# Altium schematic sheet Schematic_Phat.SchDoc
size A; PageSetup: Record=PageOptions|CenterHorizontal=True|CenterVertical=True|PrintScale=1.00|XCorrection=1.00|YCorrection=1.00|PrintKind=0|BorderSize=5000000|LeftOffset=0|BottomOffset=0|Orientation=2|PaperLength=1000|PaperWidth=1000|Scale=100|PaperSource=7|PrintQuality=-3|MediaType=1|DitherType=10|PrintScaleMode=0|PaperKind=A4|PaperIndex=9
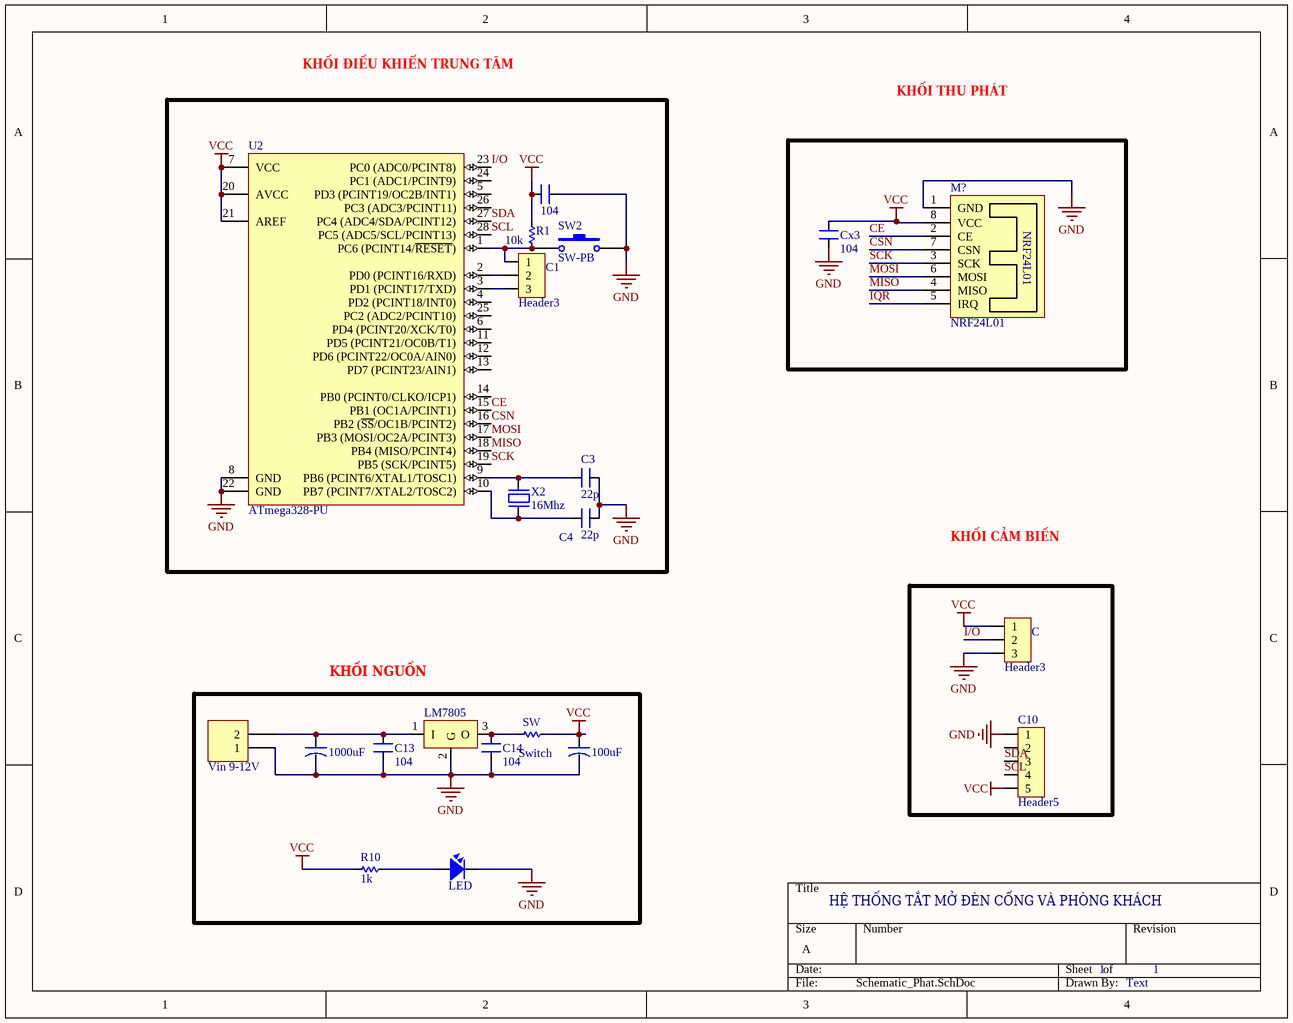
[diagram p0: Schematic_Phat.SchDoc]

## Parts
100uF  CN-ALU-DIP  [CA-ALU-2.54]  (value not drawn)
1000uF  CN-ALU-DIP  [CA-ALU-2.54]  (value not drawn)
?  104  [CN-SMD-0805]
C  Header3  [HDR3]
C1  Header3  [HDR3]
C3  22p  [CN-SMD-0805]
C4  22p  [CN-SMD-0805]
C10  Header5  [HDR5]
C13  104  [CN-SMD-0805]
C14  104  [CN-SMD-0805]
Cx3  104  [CN-SMD-0805]
LED  LED  [LED-3MM-RED]  (value not drawn)
LM7805  LM78xx  [TO220-123]  (value not drawn)
M?  NRF24L01  [JP4-C2T]
R1  10k  [RES-SMD-0805]
R10  1k  [RES-SMD-0805]
SW  Switch  [RES-1/4W-SMALL]
SW2  SW-PB  [SPST-2]
U2  ATmega328-PU  [DIP28]
Vin_9-12V  Domino 2  [DOMINO 2- 5mm]  (value not drawn)
X2  16Mhz  [XT2]

## Blocks framed on the sheet
KHỐI NGUỒN: 100uF 1000uF C13 C14 LED LM7805 R10 SW Vin_9-12V

## Nets
GND: 100uF.2 1000uF.2 ?.1 C.3 C3.1 C4.1 C10.1 C13.1 C14.1 Cx3.1 LED.2 LM7805.2(G) M?.1(GND) SW2.2 U2.8(GND) U2.22(GND) Vin_9-12V.1
VCC: 100uF.1 ?.2 C.1 C10.5 Cx3.2 M?.8(VCC) R1.1 R10.2 SW.1 U2.7(VCC) U2.20(AVCC) U2.21(AREF)
CE: M?.2(CE) U2.15(PB1_(OC1A/PCINT1))
CSN: M?.7(CSN) U2.16(PB2_(~{SS}/OC1B/PCINT2))
I/O: C.2 U2.23(PC0_(ADC0/PCINT8))
IQR: M?.5(IRQ)
MISO: M?.4(MISO) U2.18(PB4_(MISO/PCINT4))
MOSI: M?.6(MOSI) U2.17(PB3_(MOSI/OC2A/PCINT3))
SCK: M?.3(SCK) U2.19(PB5_(SCK/PCINT5))
SCL: C10.4 U2.28(PC5_(ADC5/SCL/PCINT13))
SDA: C10.3 U2.27(PC4_(ADC4/SDA/PCINT12))
Net1000uF_1: 1000uF.1 C13.2 LM7805.1(I) Vin_9-12V.2
NetC1_1: C1.1 R1.2 SW2.1 U2.1(PC6_(PCINT14/~{RESET}))
NetC1_2: C1.2 U2.2(PD0_(PCINT16/RXD))
NetC1_3: C1.3 U2.3(PD1_(PCINT17/TXD))
NetC3_2: C3.2 U2.9(PB6_(PCINT6/XTAL1/TOSC1)) X2.2
NetC4_2: C4.2 U2.10(PB7_(PCINT7/XTAL2/TOSC2)) X2.1
NetC14_2: C14.2 LM7805.3(O) SW.2
NetLED_1: LED.1 R10.1

Not connected (* = marked no-connect by the designer): C10 2; U2 4(PD2_(PCINT18/INT0)) 5(PD3_(PCINT19/OC2B/INT1)) 6(PD4_(PCINT20/XCK/T0)) 11(PD5_(PCINT21/OC0B/T1)) 12(PD6_(PCINT22/OC0A/AIN0)) 13(PD7_(PCINT23/AIN1)) 14(PB0_(PCINT0/CLKO/ICP1)) 24(PC1_(ADC1/PCINT9)) 25(PC2_(ADC2/PCINT10)) 26(PC3_(ADC3/PCINT11))

## Notes on the sheet
- KHỐI ĐIỀU KHIỂN TRUNG TÂM
- KHỐI THU PHÁT
- KHỐI CẢM BIẾN
- HỆ THỐNG TẮT MỞ ĐÈN CỔNG VÀ PHÒNG KHÁCH
- 1
- Text

## Library data of the parts
100uF 1000uF = CN-ALU-DIP: Capacitor (Semiconductor SIM Model); Value: 104; LatestRevisionDate: 17-Jul-2002; LatestRevisionNote: Re-released for DXP Platform.; PackageReference: C1206; Publisher: Altium Limited
? C3 C4 C13 C14 Cx3 = CN: Value: 33pF
C C1 = Header3: Header IDC, 3 x 1 Pin Vertical 2.54mm Pitch (Non-Boxed, Male); Manufacturer: W¨¹rth Elektronik eiSos GmbH; partNo: 613002143121; ComponentLink1 Description: Manufacturer; ComponentLink2 Description: Datasheet; NoPins: 02; Created Date: 29 March 2013; ComponentLink1URL: http://www.we-online.com; ComponentLink2URL: http://katalog.we-online.de/em/datasheet/6130xx143121.pdf; Created by: Karrer Zheng
C10 = Header5: Header IDC, 5 x 1 Pin Vertical 2.54mm Pitch (Non-Boxed, Male); Manufacturer: W¨¹rth Elektronik eiSos GmbH; partNo: 613002143121; ComponentLink1 Description: Manufacturer; ComponentLink2 Description: Datasheet; NoPins: 02; Created Date: 29 March 2013; ComponentLink1URL: http://www.we-online.com; ComponentLink2URL: http://katalog.we-online.de/em/datasheet/6130xx143121.pdf; Created by: Karrer Zheng
LED = LED: LED Single colour Green and Red; Value: LED 3 ly Single Colour
LM7805 = LM78xx: Positive Voltage Regulator; Note: Tab is connected to pin 3 (GND).; Published: 24-Aug-2001; LatestRevisionDate: 17-Jul-2002; LatestRevisionNote: Re-released for DXP Platform.; DatasheetVersion: Apr-1994; PackageVersion: Jul-1998; PackageReference: ISOWATT220AB; Publisher: Altium Limited; PackageDescription: TO, Thru-Hole, Vertical, Heatsink Mounted; 3 In-Line Leads; Pitch 2.54 mm; Pin sequence 1, 3, 2; ComponentLink1Description: Manufacturer Link; ComponentLink1URL: http://www.st.com/; ComponentLink2Description: Datasheet; ComponentLink2URL: http://www.st.com/stonline/products/literature/ds/2146/l78m05c.pdf
R1 R10 = Res-SMD: Resistor; Manufacturer: Generic Components; Class: Passive; Published: 08/06/2000; Publisher: Altium Hobart Technology Centre
SW = Res: Manufacturer: Generic Components; Class: Passive; SubClass: R; Published: 08/06/2000; Publisher: Altium Hobart Technology Centre
SW2 = SW-PB: Switch; Published: 24-Mar-1999; LatestRevisionDate: 17-Jul-2002; LatestRevisionNote: Re-released for DXP Platform.; PackageReference: SPST-2; Publisher: Altium Limited; PackageDescription: Switch; 2 Leads
U2 = ATmega328-PU: 8-bit AVR Microcontroller, 32KB Flash, 1KB EEPROM, 2KB SRAM, 28-pin PDIP, Industrial Grade (-40°C to 85°C); Published: 1-Apr-2010; DatasheetVersion: revA, Jan-2010; PackageVersion: revB, Sep-2001; PackageReference: 28P3; Publisher: Altium Limited; PackageDescription: 28-lead (0.300"/7.62mm Wide) Plastic Dual Inline Package (PDIP); Supplier 1: Digi-Key; Supplier Part Number 1: ATMEGA328-PU-ND; Supplier 2: Mouser; Supplier Part Number 2: 556-ATMEGA328-PU; ComponentLink1Description: Manufacturer Link; ComponentLink1URL: http://www.atmel.com/products/avr/default.asp?; ComponentLink2Description: ATmega48A/48PA/88A/88PA/168A/168PA/328/328P Datasheet; ComponentLink2URL: http://www.atmel.com/dyn/resources/prod_documents/8271.pdf; ComponentLink3Description: ATmega48A/48PA/88A/88PA/168A/168PA/328/328P Summary; ComponentLink3URL: http://www.atmel.com/dyn/resources/prod_documents/8271S.pdf; ComponentLink4Description: Atmel.com Home; ComponentLink4URL: http://www.atmel.com
Vin_9-12V = Domino 2: Domino, 2-Pin; LatestRevisionDate: 17-Jul-2002; LatestRevisionNote: Re-released for DXP Platform.; Publisher: Altium Limited
X2 = XT2: Crystal, 32.768 KHz, -40 to 85 degC, 3.2 x 1.5 x 0.9 mm SMD; Value: 4Mhz